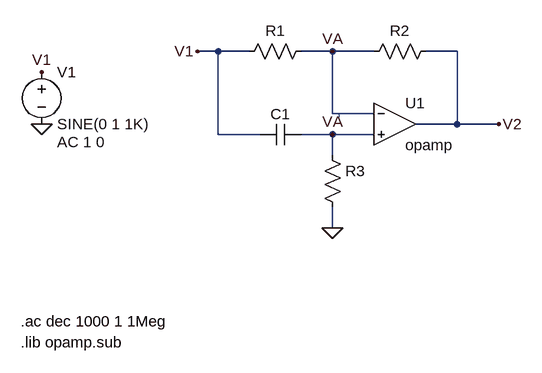
[diagram p0: schematic ejercicio_sin_normalizar.asc]
ejercicio_sin_normalizar.asc, the LTspice schematic file:
Version 4.1
SHEET 1 880 680
WIRE 288 -16 256 -16
WIRE 336 -16 288 -16
WIRE 464 -16 416 -16
WIRE 528 -16 464 -16
WIRE 656 -16 608 -16
WIRE 464 80 464 -16
WIRE 528 80 464 80
WIRE 656 96 656 -16
WIRE 656 96 592 96
WIRE 720 96 656 96
WIRE 288 112 288 -16
WIRE 352 112 288 112
WIRE 464 112 416 112
WIRE 528 112 464 112
WIRE 464 144 464 112
WIRE 464 256 464 224
FLAG 720 96 V2
FLAG 256 -16 V1
FLAG 16 96 0
FLAG 16 16 V1
FLAG 464 256 0
FLAG 464 -16 VA
FLAG 464 112 VA
SYMBOL res 432 -32 R90
WINDOW 0 0 56 VBottom 2
WINDOW 3 32 56 VTop 2
SYMATTR InstName R1
SYMATTR Value ""
SYMBOL res 624 -32 R90
WINDOW 0 0 56 VBottom 2
WINDOW 3 32 56 VTop 2
SYMATTR InstName R2
SYMATTR Value ""
SYMBOL res 448 128 R0
SYMATTR InstName R3
SYMATTR Value ""
SYMBOL OpAmps\\opamp 560 32 R0
SYMATTR InstName U1
SYMBOL cap 416 96 R90
WINDOW 0 0 32 VBottom 2
WINDOW 3 32 32 VTop 2
SYMATTR InstName C1
SYMATTR Value ""
SYMBOL voltage 16 0 R0
WINDOW 123 24 124 Left 2
WINDOW 39 0 0 Left 0
SYMATTR Value2 AC 1 0
SYMATTR InstName V1
SYMATTR Value SINE(0 1 1K)
TEXT -16 432 Left 2 !.lib opamp.sub
TEXT -16 400 Left 2 !.ac dec 1000 1 1Meg
TEXT 472 88 Left 2 ;'

The netlist it stands for:
* ejercicio_sin_normalizar.asc
R1 VA V1
R2 V2 VA
R3 VA 0
X§U1 VA VA V2 opamp Aol=100K GBW=10Meg  ; pins invin noninvin out
C1 VA V1
V1 V1 0 SINE(0 1 1K) AC 1 0
.lib opamp.sub
.ac dec 1000 1 1Meg
* '
.backanno
.end